# EAGLE design dreamcast-universal-power-supply (EAGLE 9.6.2)
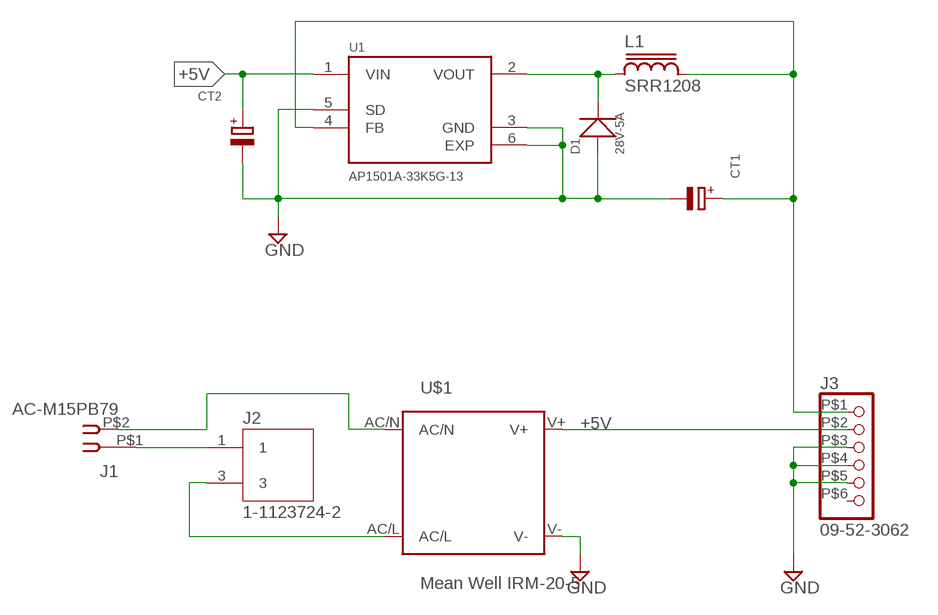
[diagram p0: schematic, sheet 1]

## Parts
CT1  C-POL_ECAP-8.5MM  [CAPAE830X1050N]
CT2  C-POL_ECAP-8.5MM  [CAPAE830X1050N]
D1  28V-5A  SMD-DIODE-SCHOTTKY-28V-5A(DO-214AA)  [DO-214AA]
J1  AC-M15PB79  [AC-M15PB79]
J2  1-1123724-2  [TE_1-1123724-2]
J3  09-52-3062  [09-52-3062]
L1  SRR1208  [SSR1208]
U1  AP1501A-33K5G-13  [DPAK171P1524X485-6N]
U$1  Mean Well IRM-20-5  IRM_15/20IRM_15/20  [IRM_15/20]

## Nets
1: J1.P$1 J2.1
2: J1.P$2 U$1.AC/N
+5V: CT2.1(+) J3.P$2 U1.1(VIN) U$1.V+
GND: CT1.2(-) CT2.2(-) D1.+ J3.P$3 J3.P$4 J3.P$5 U1.3(GND) U1.5(SD) U1.6(EXP) U$1.V-
N$1: J2.3 U$1.AC/L
N$2: D1.- L1.1 U1.2(VOUT)
N$3: CT1.1(+) J3.P$1 L1.2 U1.4(FB)
Unconnected: J3.P$6

## Library data of the parts
CT1 CT2 = Capacitor:C-POL: Capacitor Polarised - Generic; CATEGORY: Capacitor
D1 = OPL_Discrete_Semiconductor:SMD-DIODE-SCHOTTKY-28V-5A(DO-214AA): 304020021; MPN: SS54B
J1 = EDK AC-M15PB79:AC-M15PB
J2 = 1-1123724-2:1-1123724-2: Economy Power Series 3 Position 7.92 mm Pitch Single Row Wire to Board Plug; AVAILABILITY: Unavailable; CENTERLINE_PITCH: 3.96 mm[.156 in]; COMMENT: 1-1123724-2; DESCRIPTION: Economy Power Series 3 Position 7.92 mm Pitch Single Row Wire to Board Plug; DIGIKEY-PURCHASE-URL: https://snapeda.com/shop?store=DigiKey&id=2779171; MF: TE Connectivity; MOUSER-PURCHASE-URL: https://snapeda.com/shop?store=Mouser&id=2779171; MP: 1-1123724-2; NUMBER_OF_POSITIONS: 3; PACKAGE: None; PRICE: None; PRODUCT_TYPE: Header
J3 = Molex KK 156 09-52-3062:09-52-3062: Molex 09-52-3062 KK 156 Housing Assy PC Tail Bottom Entry
L1 = inductor-bourns:SRR1208: POWER INDUCTOR
U1 = AP1501A-33K5G-13:AP1501A-33K5G-13: Voltage stabiliser; PMIC; 5A; TO263-5; SMD; buck; -20÷85°C; 800pcs.; AVAILABILITY: Unavailable; DESCRIPTION: Buck Switching Regulator IC Positive Fixed 3.3V 1 Output 5A TO-263-6, D²Pak (5 Leads + Tab), TO-263BA; MF: Diodes Inc.; MP: AP1501A-33K5G-13; PACKAGE: TO-263-5 Diodes Inc.; PRICE: None
U$1 = meanwell_irm_v7:IRM_15/20: 15 or 20 watt housing & pin compatible IRM 15 Vout [V] Imax [A] Pmax [W] Eff [%] 3.3 3.5 11.55 74 5 3 15 78 12 1.25 15 82 15 1 15 82 24 0.63 15.12 83 IRM 20 Vout [V] Imax [A] Pmax [W] Eff [%] 3.3 4.5 14.85 76 5 4 20 79 12 1.8 21.6 84 15 1.4 21.6 84 24 0.9 21.6 85

## Board
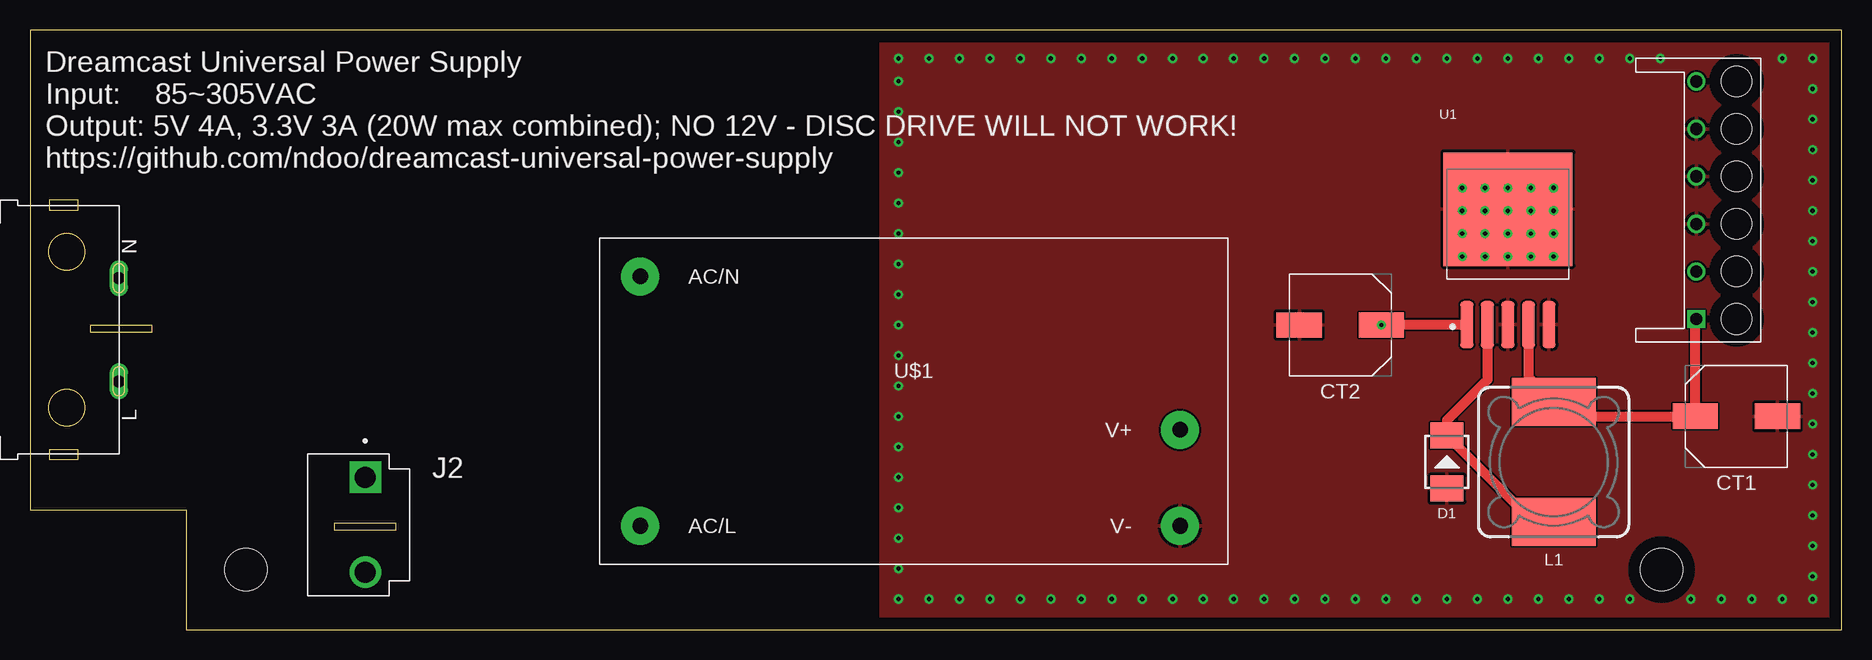
[diagram p1: board, top side]
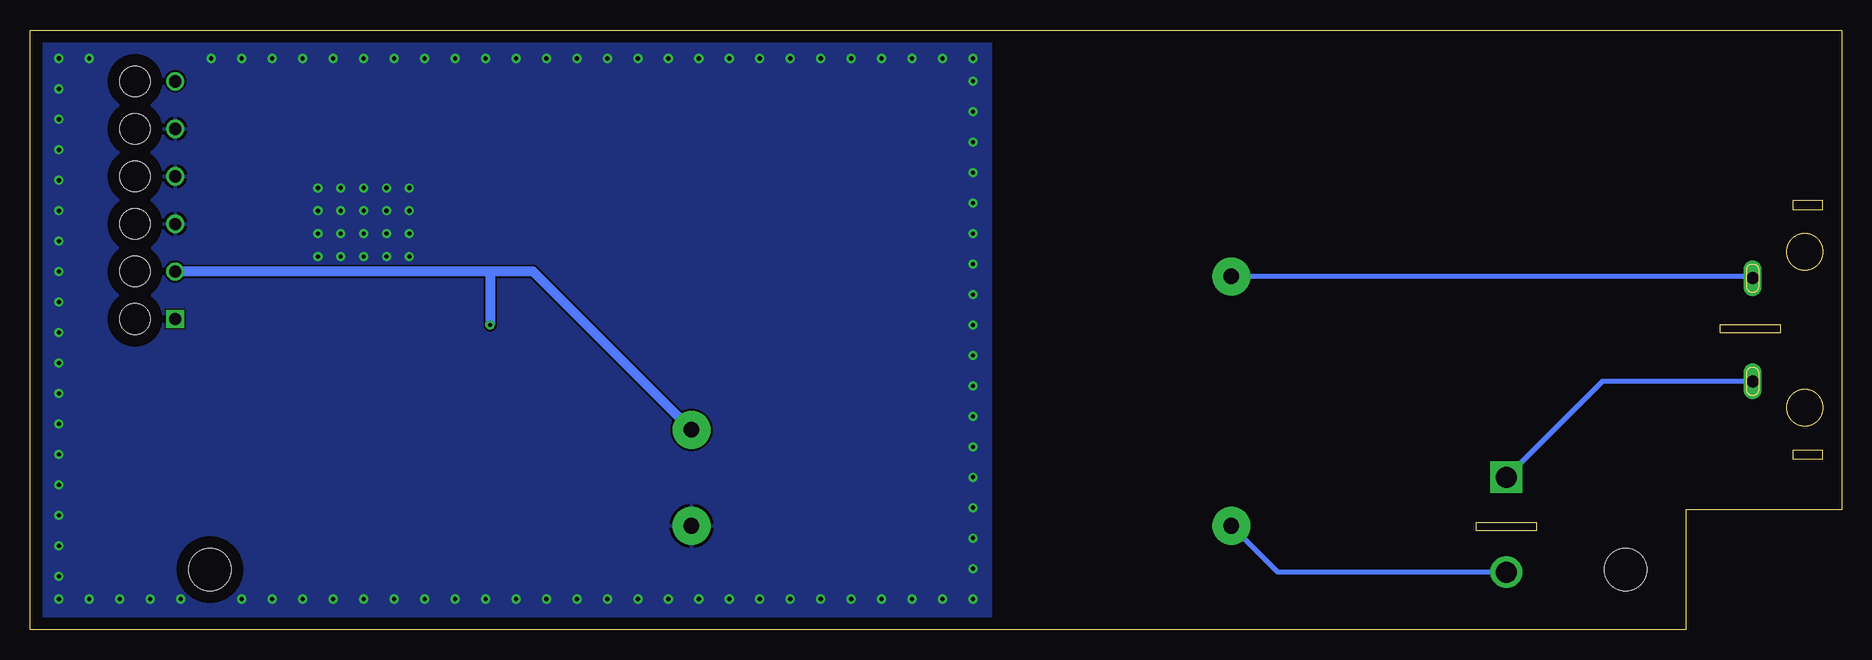
[diagram p2: board, bottom side, seen from below]

Size 151 x 50 mm. Coordinates in mm from the lower left corner, seen from the top.
Outline: 13,0 151,0 151,50 0,50 0,10 13,10 13,0
Copper layers (1*16): Top 0.035mm / dielectric 1.5mm / Bottom 0.035mm
Design rules "default": minimum track width 6mil, minimum drill 0.35mm, track to track 6mil, track to pad 6mil, pad to pad 6mil, via to via 6mil, smd to smd 6mil, copper to edge 40mil, drill to drill 6mil, minimum pad ring 10mil, minimum via ring 8mil, stop-mask expansion 4mil, vias tented up to drill 0mil, thermal gap 10mil
Holes 3.5 mm at 136,5 18,5
Milling: area 5.1,24.8 to 10.2,25.4; area 25.4,8.3 to 30.5,8.9

### Footprints (pad centres in the part's own frame; a part is rotated, then mirrored left to right if it is on the bottom)
CAPAE830X1050N = smd 3.764 x 2.115: 1 -3.426,0; 2 3.426,0
DO-214AA = smd 2.159 x 2.743: + -2.21,0; - 2.21,0
AC-M15PB79 = drill 1 long: P$1 -4.3,-9.95; P$2 4.3,-9.95
TE_1-1123724-2 = drill 1.75 pad 2.63 square: 1 0,0 | drill 1.75 pad 2.63: 3 7.92,0
09-52-3062 = drill 1.016 square: P$1 0,0 | drill 1.016: P$2 -3.962,0; P$3 -7.925,0; P$4 -11.887,0; P$5 -15.85,0; P$6 -19.812,0 | hole 2.54: -19.812,3.353; -15.85,3.353; -11.887,3.353; -7.925,3.353; -3.962,3.353; 0,3.353
SSR1208 = smd 7 x 4: 1 0,5; 2 0,-5
DPAK171P1524X485-6N = smd 1.1 x 3.93: 1 -3.42,-6.33; 2 -1.71,-6.33; 3 0,-6.33; 4 1.71,-6.33; 5 3.42,-6.33 | smd 10.75 x 9.45: 6 0,3.3
IRM_15/20 = drill 1.3 pad 3.17: AC/L -22.8,-10.4; AC/N -22.8,10.4; V+ 22.2,-2.4; V- 22.2,-10.4

### Placement (x,y rotation side)
CT1  142.24,17.78 0 top
CT2  109.22,25.4 180 top
D1  118.11,13.97 90 top
J1  -2.54,25 90 top
J2  27.94,12.7 270 top
J3  138.9,25.9 270 top
L1  127,13.97 180 top
U1  123.19,31.75 0 top
U$1  73.66,19.05 0 top

### Tracks (layer width: path | path; a pad name or v marks a point on that pad's centre or on a via)
1
  Bottom 0.406: J1.P$1 19.94,20.7 J2.1
2
  Bottom 0.406: J1.P$2 7.56,29.45 U$1.AC/N
+5V  (via drill 0.35)
  Top 0.813: CT2.1 112.67,25.42 U1.1
  Bottom 0.813: U$1.V+ 109.07,29.86 112.65,29.86 | 112.65,29.86 J3.P$2 | 112.65,29.86 CT2.1
  other vias: 112.65,25.4
GND  (via drill 0.35)
  other vias: 123.19,34.92 121.28,34.92 125.09,34.92 127,34.92 127,36.83 125.09,36.83 123.19,36.83 121.28,36.83 119.38,36.83 119.38,34.92 119.38,33.02 119.38,31.11 121.28,33.02 121.28,31.11 123.19,31.11 123.19,33.02 125.09,33.02 125.09,31.11 127,33.02 127,31.11 148.59,47.62 148.59,45.09 148.59,42.55 148.59,40.01 148.59,37.47 148.59,34.92 148.59,32.38 148.59,29.84 148.59,27.3 148.59,24.77 148.59,22.23 148.59,19.68 148.59,17.14 148.59,14.61 148.59,12.06 148.59,9.53 148.59,6.99 148.59,4.45 148.59,2.54 146.05,2.54 143.51,2.54 140.97,2.54 138.43,2.54 133.35,2.54 130.81,2.54 128.27,2.54 125.73,2.54 123.19,2.54 120.65,2.54 118.11,2.54 115.57,2.54 113.03,2.54 110.49,2.54 107.95,2.54 105.41,2.54 102.87,2.54 100.33,2.54 97.79,2.54 95.25,2.54 92.71,2.54 90.17,2.54 87.63,2.54 85.09,2.54 82.55,2.54 80.01,2.54 77.47,2.54 74.93,2.54 72.39,2.54 72.39,5.08 72.39,7.62 72.39,10.16 72.39,12.7 72.39,15.24 72.39,17.78 72.39,20.32 72.39,22.86 72.39,25.4 72.39,27.94 72.39,30.48 72.39,33.02 72.39,35.56 72.39,38.1 72.39,40.64 72.39,43.18 72.39,45.72 146.05,47.62 135.89,47.62 133.35,47.62 130.81,47.62 128.27,47.62 125.73,47.62 123.19,47.62 120.65,47.62 118.11,47.62 115.57,47.62 113.03,47.62 110.49,47.62 107.95,47.62 105.41,47.62 102.87,47.62 100.33,47.62 97.79,47.62 95.25,47.62 92.71,47.62 90.17,47.62 87.63,47.62 85.09,47.62 82.55,47.62 80.01,47.62 77.47,47.62 74.93,47.62 72.39,47.62
  pour Top: 151,50 151,0 70.95,0 70.95,50
  pour Bottom: 151,50 151,0 70.95,0 70.95,50
N$1
  Bottom 0.406: J2.3 46.99,4.78 U$1.AC/L
N$2
  Top 0.813: U1.2 121.48,20.82 118.11,17.45 D1.- 125.32,8.97 L1.1
N$3
  Top 0.813: U1.4 124.9,21.07 L1.2 128.19,17.78 CT1.1 138.81,25.81 J3.P$1

### Text on the board
tNames: Dreamcast Universal Power Supply / Input: 85~305VAC / Output: 5V 4A, 3.3V 3A (20W max combined); NO 12V - DISC DRIVE WILL NOT WORK! / https://github.com/ndoo/dreamcast-universal-power-supply